# EAGLE design Radio Board (EAGLE 9.5.1)
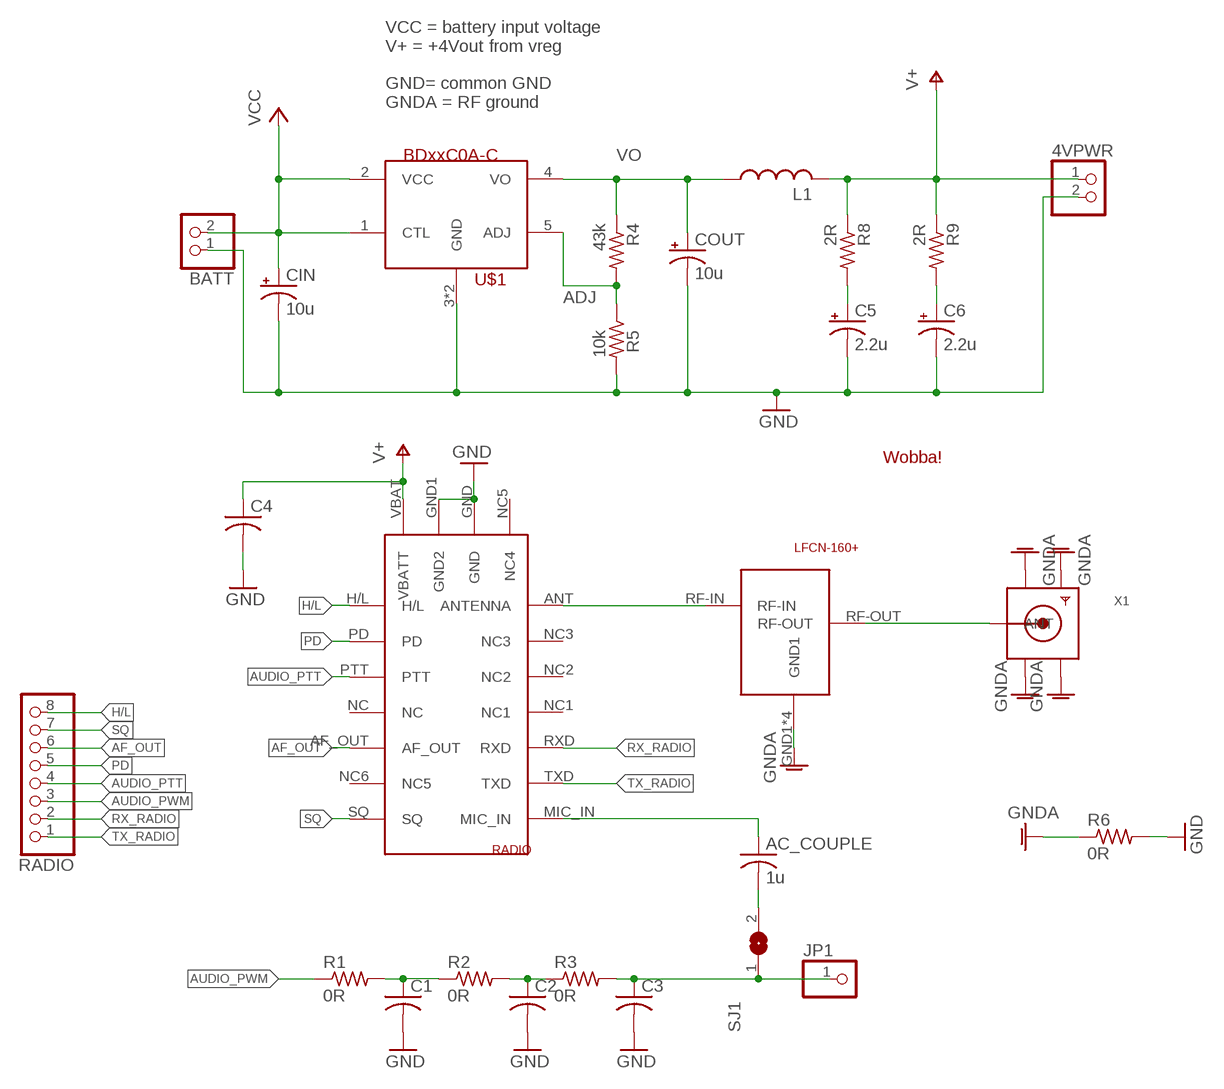
[diagram p0: schematic, sheet 1]

## Parts
4VPWR  PINHD-1X2  [1X02]
AC_COUPLE  1u  C-USC0805  [C0805]
BATT  PINHD-1X2  [1X02]
C1  C-USC0805  [C0805]
C2  C-USC0805  [C0805]
C3  C-USC0805  [C0805]
C4  100n  C-USC0805  [C0805]
C5  2.2u  CPOL-USA  [PANASONIC_A]
C6  2.2u  CPOL-USA  [PANASONIC_A]
CIN  10u  CPOL-USA  [PANASONIC_A]
COUT  10u  CPOL-USA  [PANASONIC_A]
JP1  PINHD-1X1  [1X01]
L1  L-USL3225M  [L3225M]
R1  0R  R-US_R0805  [R0805]
R2  0R  R-US_R0805  [R0805]
R3  0R  R-US_R0805  [R0805]
R4  43k  R-US_R0805  [R0805]
R5  10k  R-US_R0805  [R0805]
R6  0R  R-US_R0805  [R0805]
R8  2R  R-US_R0805  [R0805]
R9  2R  R-US_R0805  [R0805]
RADIO  PINHD-1X8  [1X08]
SJ1  SJ  [SJ]
U$1  BDXXC0A-CBD00C0AWHFP-CTR  [HRP5]
U$2  WOBBUFFET  [WOBBUFFET]
U$4  RADIO  [RADIO]
U$6  LFCN-160+  [LFCN-160+]
X1  SMACONNECTOR_EDGE  [SMA_EDGELAUNCH]

## Nets
ADJ: R4.2 R5.1 U$1.5(ADJ)
AF_OUT: RADIO.6 U$4.AF_OUT
AUDIO_PTT: RADIO.4 U$4.PTT
AUDIO_PWM: R1.1 RADIO.3
GND [gnd]: 4VPWR.2 BATT.1 C1.2 C2.2 C3.2 C4.2 C5.- C6.- CIN.- COUT.- R5.2 R6.2 U$1.3(GND) U$1.6(GND) U$4.GND U$4.GND1(GND2)
GNDA [rfgnd]: R6.1 U$6.GND1 U$6.GND2(GND1) U$6.P$1(GND1) U$6.P$2(GND1) X1.GND@1(GND4) X1.GND@2(GND3) X1.GND@3(GND2) X1.GND@4(GND1)
H/L: RADIO.8 U$4.H/L
N$1 [rf]: U$4.ANT(ANTENNA) U$6.RF-IN
N$2: C1.1 R1.2 R2.1
N$3: C3.1 JP1.1 R3.2 SJ1.1
N$4: C2.1 R2.2 R3.1
N$5: AC_COUPLE.1 U$4.MIC_IN
N$6 [rf]: U$6.RF-OUT X1.P(ANT)
N$7: AC_COUPLE.2 SJ1.2
N$8: C6.+ R9.2
N$9: C5.+ R8.2
PD: RADIO.5 U$4.PD
RX_RADIO: RADIO.2 U$4.RXD
SQ: RADIO.7 U$4.SQ
TX_RADIO: RADIO.1 U$4.TXD
V+ [pwr]: 4VPWR.1 C4.1 L1.2 R8.1 R9.1 U$4.VBAT(VBATT)
VCC [pwr]: BATT.2 CIN.+ U$1.1(CTL) U$1.2(VCC)
VO [pwr]: COUT.+ L1.1 R4.1 U$1.4(VO)
Unconnected: U$4.NC U$4.NC1 U$4.NC2 U$4.NC3 U$4.NC5(NC4) U$4.NC6(NC5)

## Notes on the sheet
- VCC = battery input voltage
  V+ = +4Vout from vreg
  
  GND= common GND
  GNDA = RF ground

## Library data of the parts
4VPWR BATT = pinhead:PINHD-1X2: PIN HEADER
AC_COUPLE C1-C4 = rcl:C-US: CAPACITOR, American symbol; SPICEPREFIX: C
C5 C6 CIN COUT = rcl:CPOL-US: POLARIZED CAPACITOR, American symbol; SPICEPREFIX: C
JP1 = pinhead:PINHD-1X1: PIN HEADER
L1 = rcl:L-US: INDUCTOR, American symbol; SPICEPREFIX: L
R1-R6 R8 R9 = rcl:R-US_: RESISTOR, American symbol; SPICEPREFIX: R
RADIO = pinhead:PINHD-1X8: PIN HEADER
SJ1 = jumper:SJ: SMD solder JUMPER
U$1 = Custom Library:BDXXC0A-C
U$2 = Custom Library:WOBBUFFET
U$4 = Custom Library:RADIO
U$6 = Custom Library:LFCN-160+
X1 = adafruit:SMACONNECTOR: SMA Connector 90° DIP SMA Connector, 50 Ohm (4UConnector: 07259)

## Net classes
0 default: width 0.508 mm, clearance 0.254 mm
1 rf: width 1.626 mm, clearance 0.203 mm
2 pwr: width 0.889 mm, drill 0.381 mm, clearance 0.381 mm
3 gnd: width 0.508 mm, clearance 0.381 mm
4 rfgnd: clearance 0.381 mm to class 3

## Board
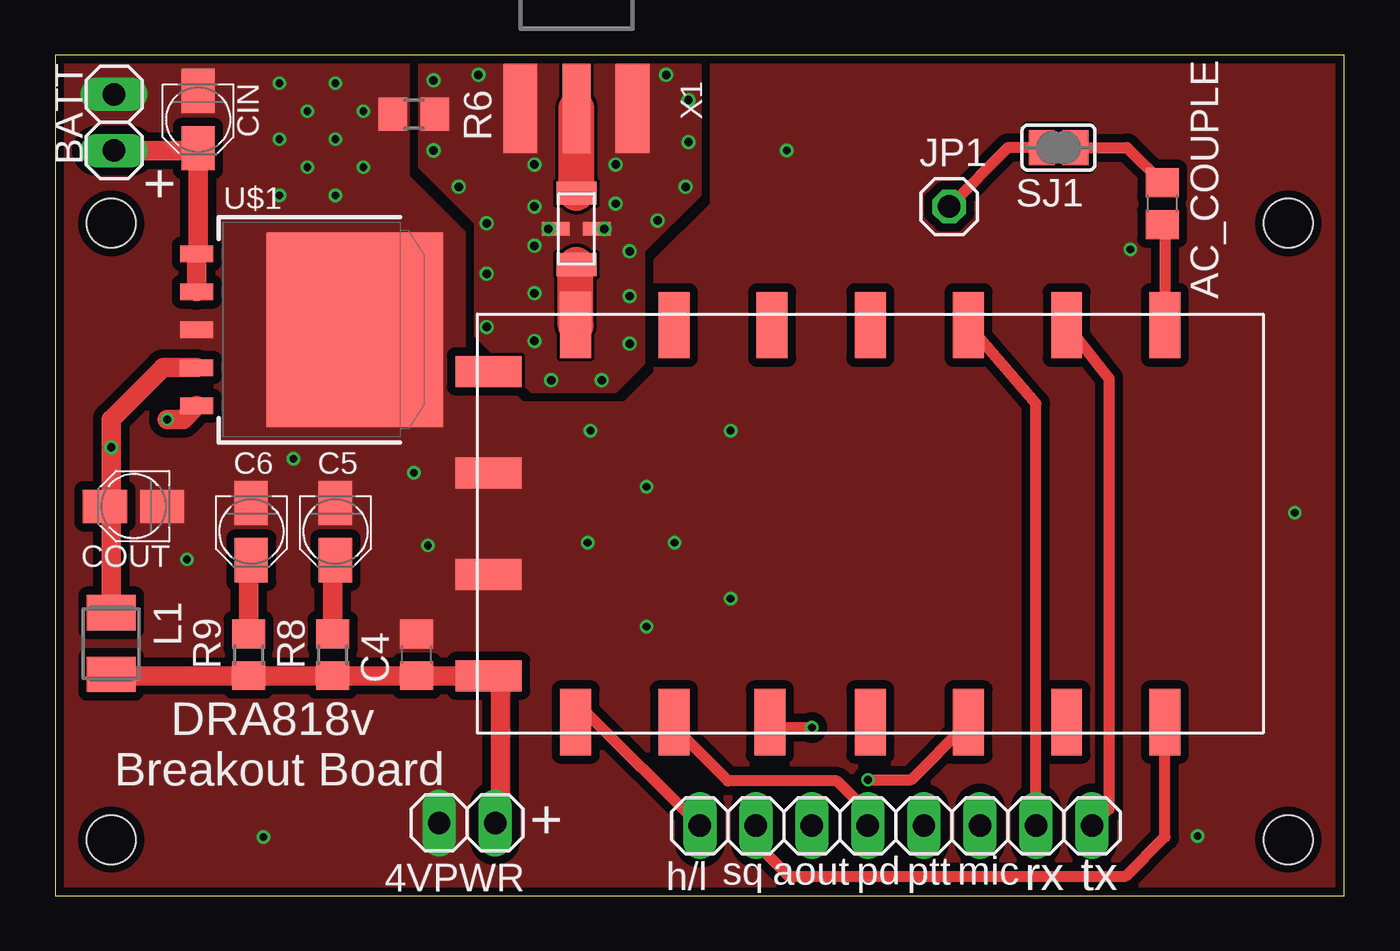
[diagram p1: board, top side]
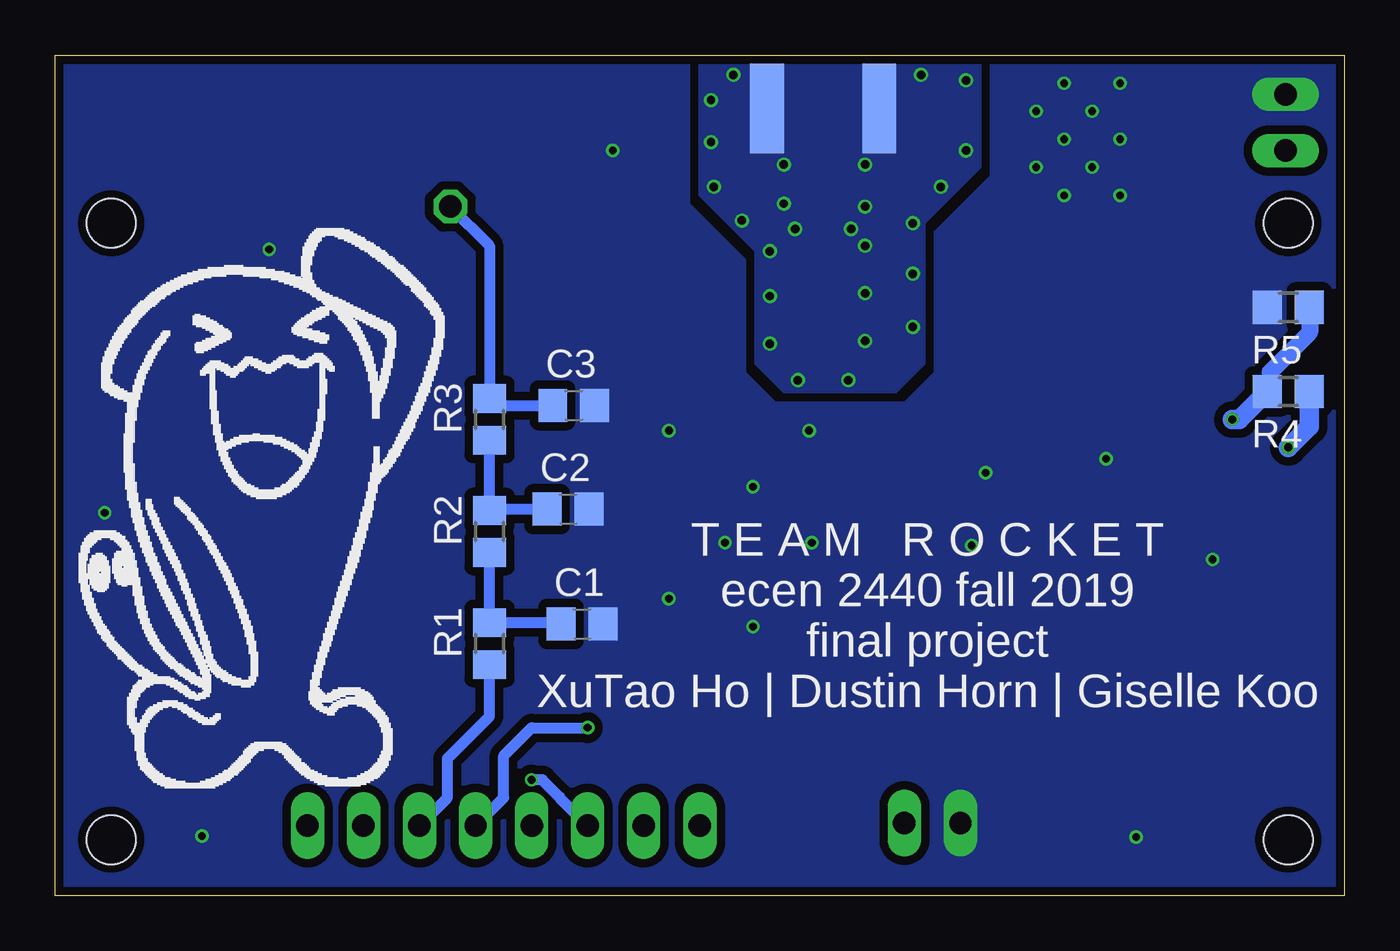
[diagram p2: board, bottom side, seen from below]

Size 58.42 x 38.1 mm. Coordinates in mm from the lower left corner, seen from the top.
Outline: 0,0 58.42,0 58.42,38.1 0,38.1 0,0
Copper layers (1*16): Top 0.035559375mm / dielectric 1.6mm / Bottom 0.035559375mm
Design rules "oshpark-2layer *": minimum track width 6mil, minimum drill 12mil, track to track 6mil, track to pad 6mil, pad to pad 6mil, via to via 6mil, smd to smd 6mil, copper to edge 15mil, drill to drill 6mil, minimum pad ring 5mil, minimum via ring 5mil, stop-mask expansion 2.5mil, vias tented up to drill 0mil, thermal gap 10mil
Holes 2.21 mm at 2.54,30.48 55.88,30.48 55.88,2.54 2.54,2.54

### Footprints (pad centres in the part's own frame; a part is rotated, then mirrored left to right if it is on the bottom)
1X02 = drill 1.016 long: 1 -1.27,0; 2 1.27,0
C0805 = smd 1.3 x 1.5: 1 -0.95,0; 2 0.95,0
PANASONIC_A = smd 2 x 1.5: + 1.3,0; - -1.3,0
1X01 = drill 1.016 octagon: 1 0,0
L3225M = smd 1.6 x 2.2: 1 -1.4,0; 2 1.4,0
R0805 = smd 1.3 x 1.5: 1 -0.95,0; 2 0.95,0
1X08 = drill 1.016 long: 1 -8.89,0; 2 -6.35,0; 3 -3.81,0; 4 -1.27,0; 5 1.27,0; 6 3.81,0; 7 6.35,0; 8 8.89,0
SJ = smd 1.168 x 1.6: 1 -0.762,0; 2 0.762,0
HRP5 = smd 0.75 x 1.5: 1 -3.44,-1.2; 2 -1.72,-1.2; 3 0,-1.2; 4 1.72,-1.2; 5 3.44,-1.2 | smd 8.8 x 8: 6 0,5.96
RADIO = smd 3 x 1.4: AF_OUT 0.5,13.35; ANT 18.5,31.15; H/L 0.5,31.15; MIC_IN 18.5,4.45; NC 18.5,17.8; NC1 18.5,22.25; NC2 18.5,26.7; NC5 0.5,17.8; NC6 0.5,8.9; PD 0.5,26.7; PTT 0.5,22.35; RXD 18.5,13.35; SQ 0.5,4.45; TXD 18.5,8.9 | smd 1.4 x 3: GND 11.8,35.1; GND1 7.2,35.1; NC3 16.4,35.1; VBAT 2.6,35.1
LFCN-160+ = smd 0.61 x 1.245: GND1 0,0.927; GND2 0,-0.927 | drill 0.381 pad 0.61: P$1 0,1.27; P$2 0,-1.27 | smd 1.04 x 1.8: RF-IN -1.625,0; RF-OUT 1.625,0
SMA_EDGELAUNCH = smd 4.064 x 1.524: GND@1 2.032,-2.54; GND@2 2.032,2.54 | smd 4.064 x 1.524 bottom: GND@3 2.032,2.54; GND@4 2.032,-2.54 | smd 4.064 x 1.27: P 2.032,0

### Placement (x,y rotation side)
4VPWR  18.67,3.3 180 top
AC_COUPLE  50.16,31.37 90 top
BATT  2.67,35.05 270 top
C1  34.54,12.32 0 bottom
C2  35.18,17.53 0 bottom
C3  34.92,22.23 0 bottom
C4  16.38,10.92 90 top
C5  12.7,16.51 270 top
C6  8.89,16.51 270 top
CIN  6.48,35.18 270 top
COUT  3.56,17.65 180 top
JP1  40.51,31.24 0 top
L1  2.54,11.43 270 top
R1  38.73,11.43 90 bottom
R2  38.73,16.51 90 bottom
R3  38.73,21.59 90 bottom
R4  2.54,22.86 180 bottom
R5  2.54,26.67 180 bottom
R6  16.26,35.43 180 top
R8  12.57,10.92 90 top
R9  8.76,10.92 90 top
RADIO  38.1,3.17 180 top
SJ1  45.47,33.91 0 top
U$1  7.62,25.65 270 top
U$2  49.44,5.08 0 bottom
U$4  54.74,7.37 90 top
U$6  23.62,30.23 90 top
X1  23.62,37.72 270 top

### Tracks (layer width: path | path; a pad name or v marks a point on that pad's centre or on a via)
ADJ  (via drill 0.35)
  Top 0.889: U$1.5 5.8,21.59 v5.08,21.59
  Bottom 0.762: R5.1 1.57,26.65 1.57,25.53 3.36,23.74 3.36,22.99 R4.2
  Bottom 0.889: v5.08,21.59 4.76,21.59 R4.2
AF_OUT  (via drill 0.35)
  Top 0.508: U$4.AF_OUT 41.39,8.24 41.3,7.76 38.8,5.25 v36.83,5.25
  Bottom 0.508: RADIO.6 35.56,4.45 35.56,4.46 36.35,5.25 v36.83,5.25
AUDIO_PTT  (via drill 0.35)
  Top 0.508: U$4.PTT 32.39,8.24 33.01,7.62 v34.29,7.62
  Bottom 0.508: RADIO.4 38.1,4.45 38.1,6.35 36.83,7.62 v34.29,7.62
AUDIO_PWM
  Bottom 0.508: RADIO.3 40.64,4.45 40.64,6.23 38.73,8.13 R1.1
GND  (via drill 0.35)
  other vias: 10.16,36.83 11.43,35.56 10.16,34.29 11.43,33.02 10.16,31.75 12.7,36.83 12.7,34.29 12.7,31.75 13.97,33.02 13.97,35.56 10.79,19.81 16.26,19.18 16.89,15.88 5.97,15.24 9.44,2.67 24.13,16 26.8,18.54 24.26,21.08 30.61,21.08 28.07,16 26.8,12.19 30.61,13.46 33.15,33.78 48.73,29.29 56.18,17.36 51.77,2.71
  pour Top (rank 2, no thermals): 0,38.1 58.42,38.1 58.42,0 0,0
  pour Bottom (rank 2, no thermals): 58.42,38.1 0,38.1 0,0 58.42,0
GNDA  (via drill 0.38)
  other vias: 17.14,36.96 17.14,33.78 19.56,30.48 19.56,28.19 19.56,25.78 18.29,32.13 21.72,25.15 22.48,23.37 24.77,23.37 26.04,25.02 26.04,27.18 26.04,29.21 27.3,30.61 28.57,32.13 28.7,34.16 28.7,36.07 27.69,37.21 19.18,37.21 25.4,31.37 21.72,31.24 21.72,29.46 21.72,27.3 21.72,33.15 25.4,33.15
  pour Top (no thermals): 16.51,38.1 16.51,33.02 19.05,30.48 19.05,25.4 21.59,22.86 25.4,22.86 26.67,24.13 26.67,29.21 29.21,31.75 29.21,38.1
  pour Bottom (no thermals): 29.21,38.1 29.21,31.75 26.67,29.21 26.67,24.13 25.4,22.86 20.32,22.86 19.05,24.13 19.05,30.48 16.51,33.02 16.51,38.1
H/L
  Top 0.508: RADIO.8 24.02,8.37 U$4.H/L
N$1
  Top 1.626: U$4.ANT 23.59,28.57 U$6.RF-IN
N$2
  Bottom 0.508: R2.1 R1.2 35.55,12.38 C1.1
N$3
  Top 0.508: JP1.1 43.18,33.91 SJ1.1
  Bottom 0.508: JP1.1 38.73,29.46 R3.2 38.42,22.23 C3.1
N$4
  Bottom 0.508: R3.1 R2.2 38.67,17.53 C2.1
N$5
  Top 0.508: AC_COUPLE.1 50.29,30.3 U$4.MIC_IN
N$6
  Top 1.626: U$6.RF-OUT X1.P
N$7
  Top 0.508: SJ1.2 48.58,33.91 AC_COUPLE.2
N$8
  Top 0.889: C6.+ 8.76,15.08 R9.2
N$9
  Top 0.889: C5.+ 12.57,15.08 R8.2
PD
  Top 0.508: RADIO.5 36.83,3.81 35.43,5.21 30.48,5.21 28.04,7.65 U$4.PD
RX_RADIO
  Top 0.508: RADIO.2 44.45,22.3 U$4.RXD
SQ
  Top 0.508: RADIO.7 31.75,2.41 32.13,2.03 32.13,2.01 33.26,0.89 48.51,0.89 50.29,2.66 U$4.SQ
TX_RADIO
  Top 0.508: U$4.TXD 47.75,23.45 47.75,3.94 RADIO.1
V+
  Top 0.889: L1.2 2.6,9.97 R9.1 R8.1 C4.1 18.29,9.97 U$4.VBAT 20.19,9.41 20.19,4.32 20.14,3.5 4VPWR.1
VCC
  Top 0.889: BATT.2 6.38,33.78 CIN.+ 6.48,29.15 U$1.1 U$1.2
VO  (via drill 0.38)
  Top 0.889: U$1.4 4.88,23.93 2.54,21.59 v2.54,20.32 2.54,17.94 COUT.+ 2.54,17.37 L1.1
  Bottom 0.889: v2.54,20.32 1.59,21.27 R4.1

### Text on the board
tPlace: + | DRA818v / Breakout Board | + | sq | aout | pd | ptt | mic | h/l | rx | tx
bPlace: T E A M R O C K E T / ecen 2440 fall 2019 / final project / XuTao Ho | Dustin Horn | Giselle Koo